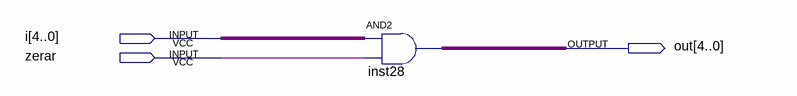
[diagram p0: schematic sheet]
// Quartus schematic Zera.bdf as structural Verilog: 1 symbols, 3 pins
module Zera (
  input  [4:0] i,
  input  zerar,
  output [4:0] out
);

  assign out = i & {5{zerar}};  // AND2 inst28, 5 bits wide
endmodule
